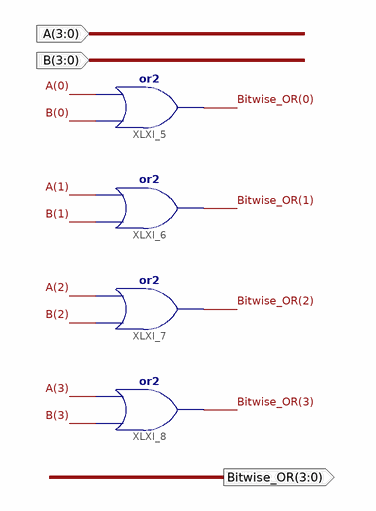
[diagram p0: schematic sheet 1]
// Xilinx ISE schematic Bitwise_OR.sch (artix7) as structural Verilog: 4 symbols, 3 ports
module Bitwise_OR (
  input  [3:0] A,
  input  [3:0] B,
  output [3:0] Bitwise_OR
);

  or XLXI_5 (Bitwise_OR[0], B[0], A[0]);
  or XLXI_6 (Bitwise_OR[1], B[1], A[1]);
  or XLXI_7 (Bitwise_OR[2], B[2], A[2]);
  or XLXI_8 (Bitwise_OR[3], B[3], A[3]);
endmodule
